# EAGLE design CSR8635-V1.2 (EAGLE 7.2.0)
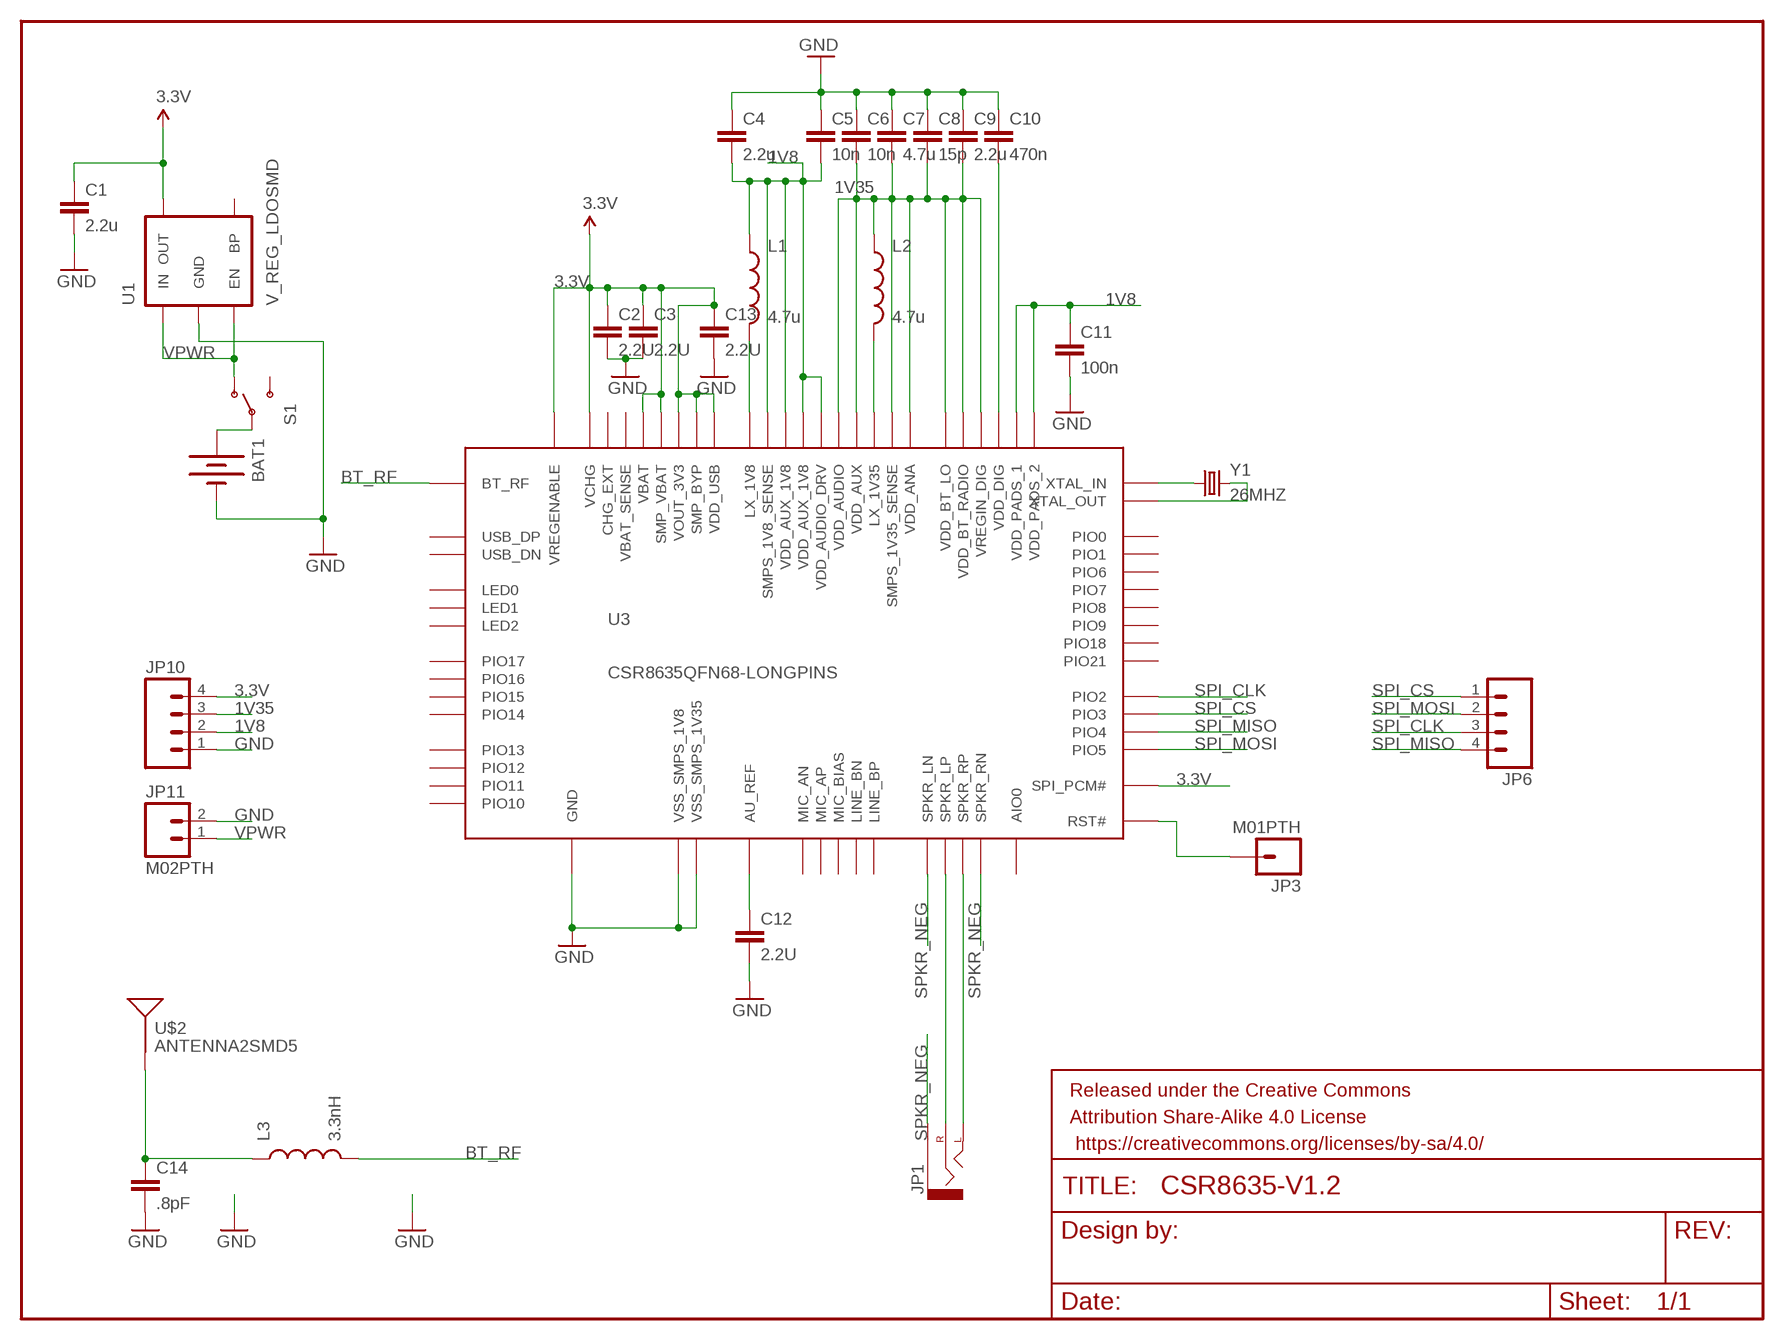
[diagram p0: schematic, sheet 1]

## Parts
BAT1  BATTERY9V  [BATTCON_9V]
C1  2.2u  CAP0603-CAP  [0603-CAP]
C2  2.2U  CAP0603-CAP  [0603-CAP]
C3  2.2U  CAP0603-CAP  [0603-CAP]
C4  2.2u  CAP0603-CAP  [0603-CAP]
C5  10n  CAP0603-CAP  [0603-CAP]
C6  10n  CAP0603-CAP  [0603-CAP]
C7  4.7u  CAP0603-CAP  [0603-CAP]
C8  15p  CAP0603-CAP  [0603-CAP]
C9  2.2u  CAP0603-CAP  [0603-CAP]
C10  470n  CAP0603-CAP  [0603-CAP]
C11  100n  CAP0603-CAP  [0603-CAP]
C12  2.2U  CAP0603-CAP  [0603-CAP]
C13  2.2U  CAP0603-CAP  [0603-CAP]
C14  .8pF  CAP0603-CAP  [0603-CAP]
FRAME1  FRAME-LETTER  [CREATIVE_COMMONS]
JP1  AUDIO-JACKSMD2  [AUDIO-JACK-3.5MM-SMD]
JP3  M01PTH  [1X01]
JP6  M04PTH  [1X04]
JP10  M04PTH  [1X04]
JP11  M02PTH  [1X02]
L1  4.7u  INDUCTOR0805  [0805]
L2  4.7u  INDUCTOR0805  [0805]
L3  3.3nH  INDUCTOR0805  [0805]
S1  SWITCH-SPDTPTH  [SWITCH-SPDT]
U1  V_REG_LDOSMD  [SOT23-5]
U3  CSR8635QFN68-LONGPINS  [QFN68]
U$2  ANTENNA2SMD5  [ANTENNA-CHIP5]
Y1  26MHZ  CRYSTALHC49US  [HC49US]

## Nets
1V8: C4.2 C5.2 C11.1 JP10.2 L1.1 U3.8(VDD_AUDIO_DRV) U3.15(VDD_AUX_1V8) U3.16(VDD_AUX_1V8) U3.33(VDD_PADS_1) U3.53(SMPS_1V8_SENSE) U3.63(VDD_PADS_2)
1V35: C6.2 C7.2 C8.2 C9.2 JP10.3 L2.1 U3.3(VDD_AUDIO) U3.11(VDD_BT_RADIO) U3.13(VDD_BT_LO) U3.14(VDD_AUX) U3.17(VDD_ANA) U3.39(VREGIN_DIG) U3.52(SMPS_1V35_SENSE)
3.3V: C1.1 C2.1 C3.1 C13.1 JP10.4 U1.5(OUT) U3.29(SPI_PCM#) U3.40(VREGENABLE) U3.41(VOUT_3V3) U3.42(VCHG) U3.45(VBAT) U3.48(SMP_VBAT) U3.49(SMP_BYP) U3.54(VDD_USB)
!SPI_PCM: JP3.1 U3.35(RST#)
BT_RF: L3.2 U3.12(BT_RF)
GND: BAT1.- C1.2 C2.2 C3.2 C4.1 C5.1 C6.1 C7.1 C8.1 C9.1 C10.1 C11.2 C12.2 C13.2 C14.2 JP10.1 JP11.2 U1.2(GND) U3.46(VSS_SMPS_1V8) U3.51(VSS_SMPS_1V35) U3.CNTR1(GND) U3.CNTR2(GND) U3.CNTR3(GND) U3.CNTR(GND)
N$1: BAT1.+ S1.2(P)
N$2: JP1.RING(RIGHT) U3.10(SPKR_LP)
N$3: L1.2 U3.47(LX_1V8)
N$4: U3.19(XTAL_IN) Y1.1
N$5: L2.2 U3.50(LX_1V35)
N$6: C10.2 U3.38(VDD_DIG)
N$7: U3.18(XTAL_OUT) Y1.2
N$8: JP1.TIP(LEFT) U3.7(SPKR_RP)
N$9: C12.1 U3.1(AU_REF)
N$10: C14.1 L3.1 U$2.FEED(SIGNAL)
SPI_CLK: JP6.3 U3.30(PIO2)
SPI_CS: JP6.1 U3.28(PIO3)
SPI_MISO: JP6.4 U3.24(PIO4)
SPI_MOSI: JP6.2 U3.34(PIO5)
SPKR_NEG: JP1.SLEEVE U3.6(SPKR_RN) U3.9(SPKR_LN)
VPWR: JP11.1 S1.1(O) U1.1(IN) U1.3(EN)
Unconnected: S1.3(S) U1.4(BP) U3.2(MIC_BIAS) U3.4(LINE_BN) U3.5(LINE_BP) U3.20(AIO0) U3.21(PIO15) U3.22(PIO12) U3.23(PIO14) U3.25(PIO10) U3.26(PIO11) U3.27(PIO16) U3.31(PIO13) U3.32(PIO17) U3.36(LED1) U3.37(LED0) U3.43(CHG_EXT) U3.44(VBAT_SENSE) U3.55(USB_DN) U3.56(USB_DP) U3.57(PIO7) U3.58(PIO9) U3.59(PIO0) U3.60(PIO1) U3.61(PIO8) U3.62(PIO6) U3.64(PIO21) U3.65(PIO18) U3.66(LED2) U3.67(MIC_AN) U3.68(MIC_AP)

## Library data of the parts
BAT1 = SparkFun-Electromechanical:BATTERY: Battery Holders Various common sizes : AA, AAA, 18650 (PRT-12895), 20mm coin cell and 12mm coin cell. 20MM_4LEGS, BATT-10373
C1-C14 = SparkFun-Passives:CAP: Capacitor Standard 0603 ceramic capacitor, and 0.1" leaded capacitor.
FRAME1 = SparkFun-Aesthetics:FRAME-LETTER: Schematic Frame Standard 8.5x11 US Letter frame
JP1 = SparkFun-Connectors:AUDIO-JACK: 3.5mm Audio Jack Simple 3.5mm common PCB mount audio jack. SKU: PRT-08032; PROD_ID: CONN-10353
JP3 = SparkFun-Connectors:M01: Header 1 Standard 1-pin 0.1" header. Use with straight break away headers (SKU : PRT-00116), right angle break away headers (PRT-00553), swiss pins (PRT-00743), machine pins (PRT-00117), and female headers (PRT-00115).
JP6 JP10 = SparkFun-Connectors:M04: Header 4 Standard 4-pin 0.1" header. Use with straight break away headers (SKU : PRT-00116), right angle break away headers (PRT-00553), swiss pins (PRT-00743), machine pins (PRT-00117), and female headers (PRT-00115). Molex polarized connector foot print use with SKU : PRT-08231 with associated crimp pins and housings. 1MM SMD Version SKU: PRT-10208
JP11 = SparkFun-Connectors:M02: Standard 2-pin 0.1" header. Use with - straight break away headers ( PRT-00116) - right angle break away headers (PRT-00553) - swiss pins (PRT-00743) - machine pins (PRT-00117) - female headers (PRT-00115) Molex polarized connector foot print use with: PRT-08233 with associated crimp pins and housings. 2.54_SCREWTERM for use with PRT-10571. 3.5mm Screw Terminal footprints for PRT-08084 5mm Screw Terminal footprints for use with PRT-08432
L1-L3 = SparkFun-Passives:INDUCTOR: Inductors Basic Inductor/Choke - 0603 and 1206. Footprints are not proven and vary greatly between part numbers. SRN6045- 33uH, 20% 1.4A SDR0403-560KL - 56uH, 10%, 500mA RMS/740mA peak
S1 = SparkFun-Electromechanical:SWITCH-SPDT: SPDT Switch Simple slide switch, Spark Fun Electronics SKU : COM-00102 DPDT SMT slide switch, AYZ0202, SWCH-08179; PROD_ID: SWCH-08261
U1 = SparkFun-PowerIC:V_REG_LDO: Voltage Regulator LDO Standard 150mA LDO voltage regulator in SOT-23 layout. Micrel part MIC5205. BP (by-pass) pin is used to lower output noise with 470pF cap.
U3 = Ilan:CSR8635
U$2 = SparkFun-RF:ANTENNA2: Chip antenna Single endded antenna. Common with smaller chip antennas. CHIP4 package is the GPS Chip Antenna SKU: GPS-08418. CHIP5 package is 2.4GHz chip antenna SKU: WRL-00144.
Y1 = SparkFun-FreqCtrl:CRYSTAL: Various standard crystals. Proven footprints.

## Board
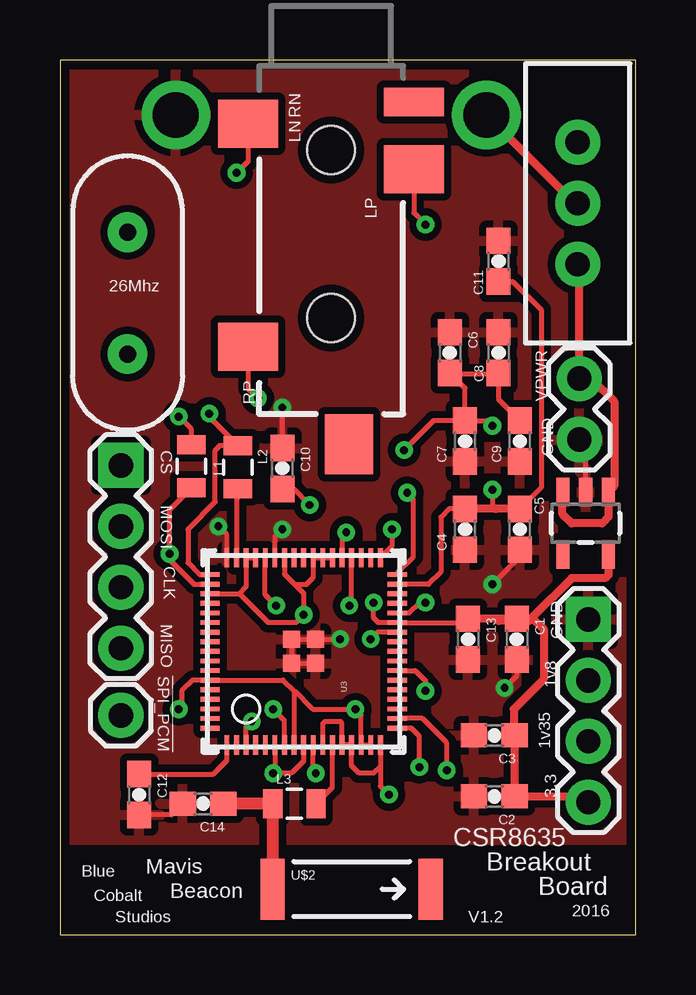
[diagram p1: board, top side]
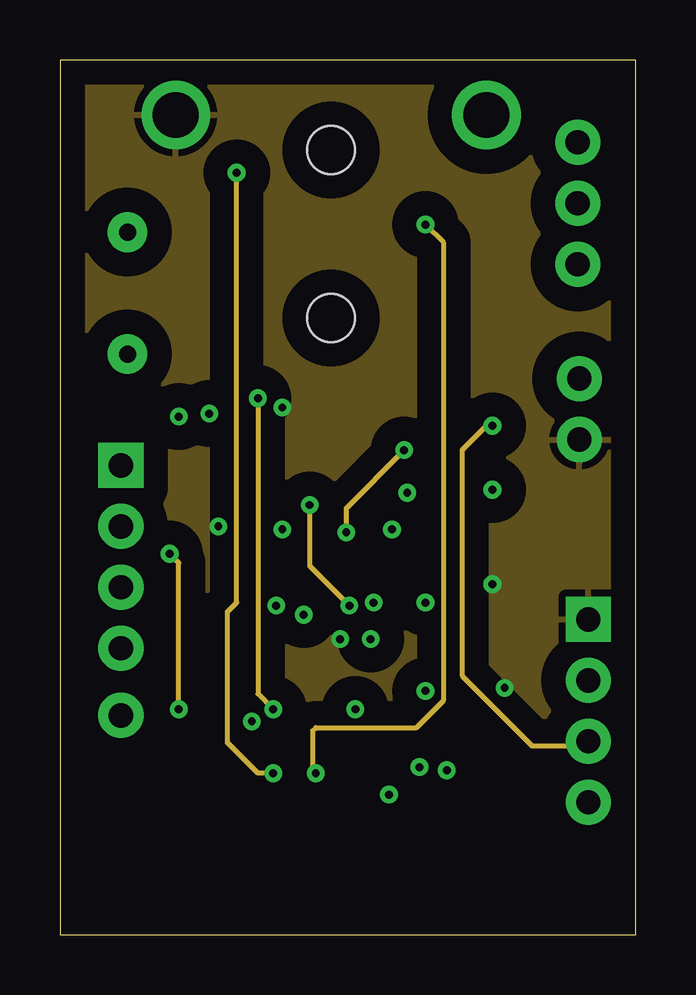
[diagram p2: board, inner layer Route2]
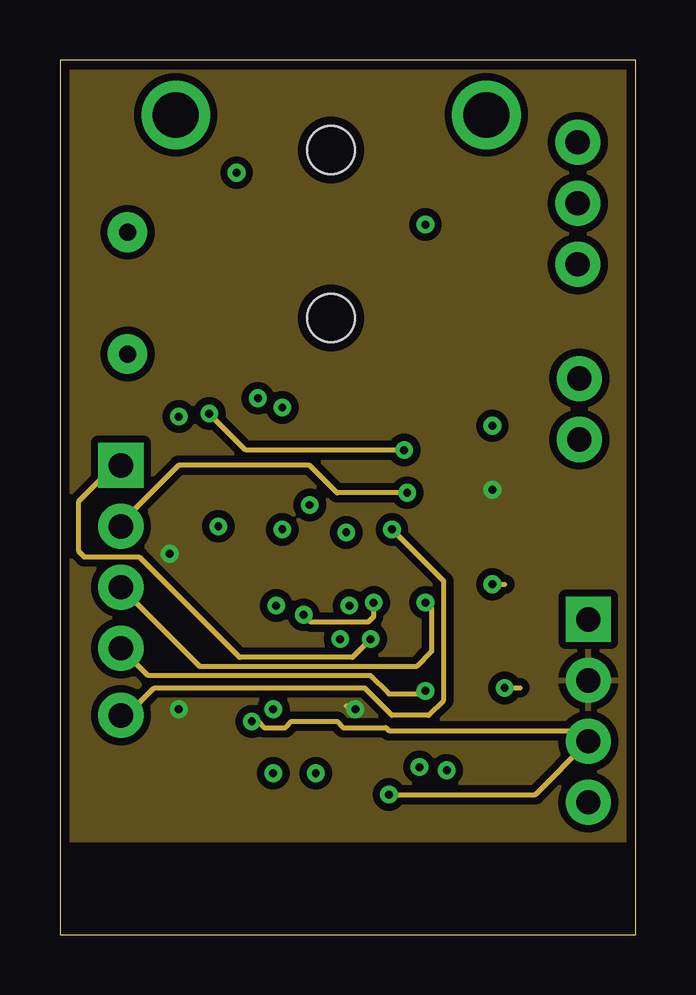
[diagram p3: board, inner layer Route15]
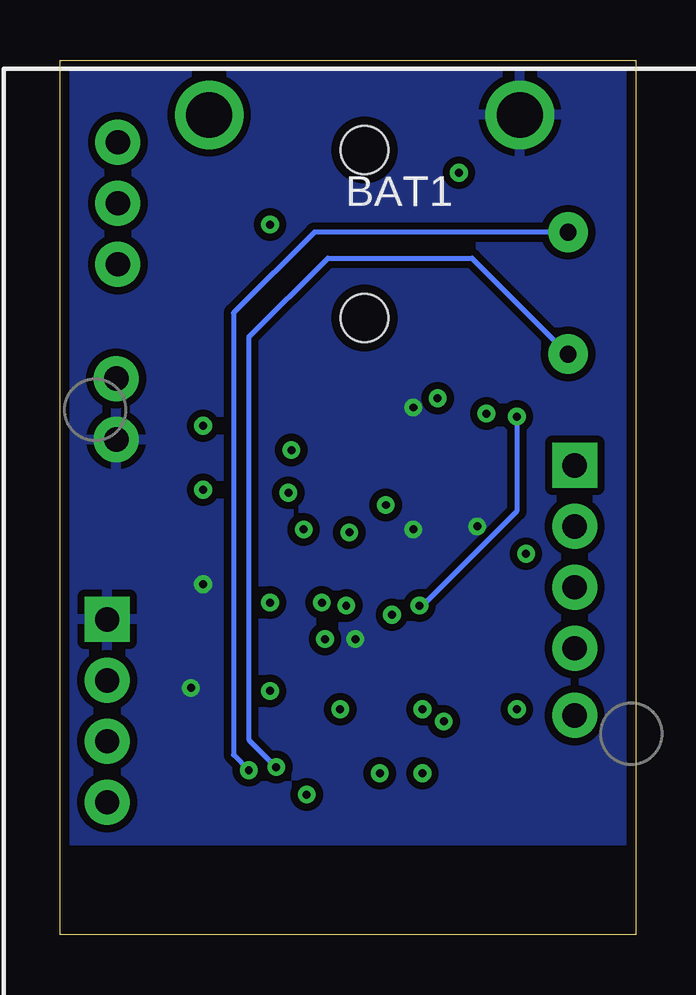
[diagram p4: board, bottom side, seen from below]

Size 24 x 36.45 mm. Coordinates in mm from the lower left corner, seen from the top.
Outline: 0,0 24,0 24,36.45 0,36.45 0,0
Copper layers (1*2*15*16): Top 0.035559375mm / dielectric 0.17018125mm / Route2 0.01778125mm / dielectric 47mil / Route15 0.01778125mm / dielectric 0.17018125mm / Bottom 0.035559375mm
Design rules "OSHPark-4layer *": minimum track width 5mil, minimum drill 10mil, track to track 7mil, track to pad 7mil, pad to pad 7mil, via to via 8mil, smd to smd 7mil, copper to edge 15mil, drill to drill 6mil, minimum pad ring 6mil, minimum via ring 8mil, stop-mask expansion 4mil, vias tented up to drill 25mil, thermal gap 12mil

### Footprints (pad centres in the part's own frame; a part is rotated, then mirrored left to right if it is on the bottom)
BATTCON_9V = drill 1.905: + 0,0; - 0,-12.954
0603-CAP = smd 1.1 x 1: 1 -0.85,0; 2 0.85,0
AUDIO-JACK-3.5MM-SMD = smd 2 x 2.5: RING 4.3,3.45; SLEEVE 2.4,-3.45; TIP 11.7,-3.45 | smd 1.2 x 2.5: RSH 1.5,3.45 | smd 2.5 x 2: TSH 15.75,0.75 | hole 2: 3.5,0; 10.5,0
1X01 = drill 1.016 pad 1.88: 1 0,0
1X04 = drill 1.016 pad 1.88 square: 1 0,0 | drill 1.016 pad 1.88: 2 2.54,0; 3 5.08,0; 4 7.62,0
1X02 = drill 1.016 pad 1.88: 1 0,0; 2 2.54,0
0805 = smd 0.8 x 1.2: 1 -0.9,0; 2 0.9,0
SWITCH-SPDT = drill 1.016 pad 1.88: 1 0,2.54; 2 0,0; 3 0,-2.54
SOT23-5 = smd 0.55 x 1.2: 1 -0.95,-1.3; 2 0,-1.3; 3 0.95,-1.3; 4 0.95,1.3; 5 -0.95,1.3
QFN68 = smd 0.8 x 0.2: 1 -3.9,3.2; 2 -3.9,2.8; 3 -3.9,2.4; 4 -3.9,2; 5 -3.9,1.6; 6 -3.9,1.2; 7 -3.9,0.8; 8 -3.9,0.4; 9 -3.9,0; 10 -3.9,-0.4; 11 -3.9,-0.8; 12 -3.9,-1.2; 13 -3.9,-1.6; 14 -3.9,-2; 15 -3.9,-2.4; 16 -3.9,-2.8; 17 -3.9,-3.2; 35 3.9,-3.2; 36 3.9,-2.8; 37 3.9,-2.4; 38 3.9,-2; 39 3.9,-1.6; 40 3.9,-1.2; 41 3.9,-0.8; 42 3.9,-0.4; 43 3.9,0; 44 3.9,0.4; 45 3.9,0.8; 46 3.9,1.2; 47 3.9,1.6; 48 3.9,2; 49 3.9,2.4; 50 3.9,2.8; 51 3.9,3.2 | smd 0.2 x 0.8: 18 -3.2,-3.9; 19 -2.8,-3.9; 20 -2.4,-3.9; 21 -2,-3.9; 22 -1.6,-3.9; 23 -1.2,-3.9; 24 -0.8,-3.9; 25 -0.4,-3.9; 26 0,-3.9; 27 0.4,-3.9; 28 0.8,-3.9; 29 1.2,-3.9; 30 1.6,-3.9; 31 2,-3.9; 32 2.4,-3.9; 33 2.8,-3.9; 34 3.2,-3.9; 52 3.2,3.9; 53 2.8,3.9; 54 2.4,3.9; 55 2,3.9; 56 1.6,3.9; 57 1.2,3.9; 58 0.8,3.9; 59 0.4,3.9; 60 0,3.9; 61 -0.4,3.9; 62 -0.8,3.9; 63 -1.2,3.9; 64 -1.6,3.9; 65 -2,3.9; 66 -2.4,3.9; 67 -2.8,3.9; 68 -3.2,3.9 | smd 0.7 x 0.7: CNTR 0.5,0.5; CNTR1 0.5,-0.5; CNTR2 -0.5,-0.5; CNTR3 -0.5,0.5
ANTENNA-CHIP5 = smd 1.016 x 2.54: FEED -3.302,0; NC 3.302,0
HC49US = drill 0.7 pad 1.651: 1 -2.54,0; 2 2.54,0

### Placement (x,y rotation side)
BAT1  17.78,34.16 90 bottom
C1  19.05,12.32 270 top
C2  18.11,5.77 180 top
C3  18.11,8.31 180 top
C4  16.89,16.89 90 top
C5  19.18,16.89 90 top
C6  16.26,24.26 270 top
C7  16.89,20.57 90 top
C8  18.29,24.26 270 top
C9  19.18,20.57 90 top
C10  9.27,19.43 270 top
C11  18.29,28.07 90 top
C12  3.3,5.84 270 top
C13  17.02,12.32 270 top
C14  5.97,5.46 180 top
FRAME1  116.59,78.49 0 top  (outside the outline)
JP1  11.3,36.2 270 top
JP3  2.54,9.14 0 top
JP6  2.54,19.56 270 top
JP10  22.03,13.14 270 top
JP11  21.65,23.17 270 top
L1  5.48,19.52 90 top
L2  7.42,19.48 270 top
L3  9.78,5.46 0 top
S1  21.59,30.48 180 top
U1  21.92,17.15 180 top
U3  10.16,11.81 90 top
U$2  12.16,1.9 0 top
Y1  2.82,26.73 270 top

### Tracks (layer width: path | path; a pad name or v marks a point on that pad's centre or on a via)
1V8  (via drill 0.33)
  Top 0.203: U3.16 U3.15 12.56,9.16 v12.32,9.4 10.54,9.4 9.78,10.16 9.75,10.16 | C4.2 16.22,17.74 15.88,17.4 15.88,15.11 15.37,14.6 U3.33 | C11.1 18.88,27.22 20.07,26.04 20.07,18.63 C5.2 18.38,17.74 | 9.75,10.16 9.3,10.61 U3.63 5.53,10.61 5.08,10.16 5.08,9.53 v4.95,9.4 | 9.75,10.16 U3.8 | v18.03,18.54 18.03,17.87 18.16,17.74 | U3.53 5.59,14.6 4.57,15.62 v4.57,15.87 4.57,17.71 L1.1
  Top 0.33: C5.2 18.16,17.74 C4.2
  Route2 0.203: v4.95,9.4 4.95,15.49 v4.57,15.87 | v18.03,18.54 18.03,18.8
  Route15 0.203: v12.32,9.4 12.19,9.53 11.94,9.53
  pour Route15 (isolate 0.305): 0,36.45 23.88,36.45 24,3.94 0,3.94
1V35  (via drill 0.33)
  Top 0.203: C7.2 16.89,22.77 C6.2 16.26,23.37 18.25,23.37 C8.2 18.29,22.31 C9.2 | U3.11 10.96,8.8 11.05,8.89 11.68,8.89 11.76,8.81 U3.13 U3.14 12.17,7.9 12.17,7.04 12.47,6.73 13.08,6.73 13.36,7.01 U3.17 13.36,6.2 v13.72,5.84 | U3.3 7.76,8.65 v8,8.89 | C7.2 17.82,21.42 v18.03,21.21 | 14.22,20.07 v14.35,20.19 15.58,21.42 C7.2 | v6.22,21.72 6.22,21.58 L2.1 6.67,20.38 6.48,20.19 6.48,18.03 5.33,16.89 5.33,15.49 5.82,15.01 U3.52 | v11.94,16.76 11.76,16.59 U3.39
  Route2 0.203: JP10.3 21.85,7.87 19.68,7.87 16.76,10.79 16.76,20.19 17.78,21.21 v18.03,21.21 | v11.94,16.76 11.94,17.78 v14.35,20.19
  Route15 0.203: v8,8.89 8.26,8.89 8.51,8.64 9.4,8.64 9.65,8.89 11.56,8.89 11.81,8.64 13.59,8.64 13.72,8.51 21.59,8.51 JP10.3 19.81,5.84 v13.72,5.84 | v14.35,20.19 7.75,20.19 v6.22,21.72
3.3V  (via drill 0.33)
  Top 0.203: U3.54 7.48,14.21 | 7.48,14.21 7.76,14.49 U3.49 U3.48 | 9.78,14.6 9.36,15.02 U3.45 | 9.78,14.6 10.29,14.6 10.56,14.88 U3.42 U3.41 U3.40 | v13.08,13.84 13.08,13.21 13.28,13.01 U3.29 16.85,13.01 C13.1 | 7.48,14.21 8.67,13.02 8.67,13.01 9.83,13.01 v10.16,13.33 10.16,14.22 9.78,14.6
  Top 0.33: JP10.4 22.03,5.77 C2.1 C3.1 18.92,8.34 18.92,9.4 20.19,10.67 20.19,12.7 19.68,13.21 | U1.5 22.87,15 22.73,14.86 21.34,14.86 19.68,13.21 | 19.68,13.21 19.56,13.08 19.14,13.08 | 19.14,13.08 C1.1 C13.1 | 19.14,13.08 18.29,13.08
  Route15 0.203: v13.08,13.84 13.08,13.26 12.85,13.03 10.46,13.03 v10.16,13.33
!SPI_PCM  (via drill 0.33)
  Top 0.203: v13.84,16.89 13.84,16.19 U3.35
  Route15 0.203: v13.84,16.89 16,14.73 16,9.78 15.37,9.14 13.84,9.14 12.7,10.29 3.94,10.29 2.79,9.14 JP3.1
BT_RF
  Top 0.203: L3.2 11.36,6.14 U3.12
GND  (via drill 0.33)
  Top 0.203: U1.2 21.92,20.37 JP11.2 | C1.2 19.05,10.79 v18.54,10.29 | C5.1 19.18,15.75 v18.03,14.6 | C10.1 v9.27,21.97 | U3.51 6.96,16.66 v6.6,17.02 | U3.46 8.96,16.58 v9.27,16.89 | U3.CNTR U3.CNTR3 U3.CNTR2 | U3.CNTR U3.CNTR1 | U3.CNTR v11.68,12.31 v11.68,12.32 | C14.2 4.65,4.99 C12.2
  Route15 0.203: 22.03,20.26 JP11.2 | v18.54,10.29 19.18,10.29 | v18.03,14.6 18.54,14.6
  Bottom 0.203: v9.27,21.97 9.27,22.1 9.4,22.23 | v6.6,17.02 6.6,17.15 6.48,17.27 | v9.27,16.89 9.27,17.15 | v11.68,12.32 11.81,12.32
  pour Top (isolate 0.305): 0,36.45 24,36.45 24,3.94 0,3.94
  pour Bottom (isolate 0.305): 0,36.45 24,36.45 24,3.94 0,3.94
  pour Route2 (isolate 1.016): 0,36.45 23.88,36.45 23.88,3.94 0,3.94
N$1
  Top 0.33: S1.2 21.46,30.48 BAT1.+
N$2  (via drill 0.33)
  Top 0.203: JP1.RING 14.75,30.08 v15.24,29.59 | v10.67,6.73 10.56,6.84 U3.10
  Route2 0.203: v15.24,29.59 16,28.83 16,9.78 14.86,8.64 10.67,8.64 10.54,8.51 10.54,6.86 v10.67,6.73
N$3  (via drill 0.33)
  Top 0.203: L1.2 5.48,21.06 v4.95,21.59 | v9.02,13.72 8.56,14.17 U3.47
  Bottom 0.203: v4.95,21.59 4.95,17.65 8.89,13.72 v9.02,13.72
N$4  (via drill 0.33)
  Top 0.203: v16.13,6.86 16.13,8 15.11,9.02 14.07,9.02 U3.19
  Bottom 0.203: Y1.1 13.4,29.27 16.76,25.91 16.76,7.49 v16.13,6.86
N$5
  Top 0.203: L2.2 7.42,18.21 7.37,18.16 7.37,15.72 U3.50
N$6  (via drill 0.33)
  Top 0.203: C10.2 9.74,18.58 v10.41,17.91 | U3.38 12.17,15.7 12.17,13.82 v12.07,13.72
  Route2 0.203: v10.41,17.91 10.41,15.37 v12.07,13.72
N$7  (via drill 0.33)
  Top 0.203: v14.99,6.99 14.99,8.28 14.66,8.61 U3.18 | U3.18
  Bottom 0.203: v14.99,6.99 16.13,8.13 16.13,24.89 12.83,28.19 6.82,28.19 Y1.2
N$8  (via drill 0.33)
  Top 0.203: JP1.TIP 7.85,22.75 v8.26,22.35 | v8.89,9.4 9.36,8.93 U3.7
  Route2 0.203: v8.26,22.35 8.26,10.03 v8.89,9.4
N$9
  Top 0.203: C12.1 6.39,6.69 6.96,7.26 U3.1 | U3.1
N$10
  Top 0.508: U$2.FEED 8.88,1.9 L3.1 C14.1
SPI_CLK  (via drill 0.33)
  Top 0.203: U3.30 14.55,13.41 14.99,13.84 v15.24,13.84
  Route15 0.203: v15.24,13.84 15.49,13.59 15.49,11.81 14.86,11.18 5.84,11.18 JP6.3
SPI_CS  (via drill 0.33)
  Top 0.203: U3.28 13.25,12.61 v12.95,12.32
  Route15 0.203: JP6.1 2.29,19.56 0.76,18.03 0.76,16 1.02,15.75 3.3,15.75 7.49,11.56 12.19,11.56 v12.95,12.32
SPI_MISO  (via drill 0.33)
  Top 0.203: U3.24 14.82,11.01 15.24,10.59 v15.24,10.16
  Route15 0.203: JP6.4 3.68,10.79 12.95,10.79 13.72,10.03 15.11,10.03 v15.24,10.16
SPI_MOSI  (via drill 0.33)
  Top 0.203: U3.34 14.06,15.08 14.73,15.75 14.73,18.16 v14.48,18.41
  Route15 0.203: v14.48,18.41 11.56,18.41 10.41,19.56 4.95,19.56 2.54,17.15 JP6.2
SPKR_NEG  (via drill 0.33)
  Top 0.203: JP1.SLEEVE 7.85,32.24 v7.37,31.75 | v8.89,6.73 8.89,6.81 8.94,6.86 | U3.9 10.16,7.24 9.65,6.73 v8.89,6.73 | U3.6 8.96,6.8 v8.89,6.73
  Route2 0.203: v8.89,6.73 8.26,6.73 6.98,8 6.98,13.46 7.37,13.84 v7.37,31.75
VPWR
  Top 0.33: U1.3 20.95,18.43 20.95,17.53 21.34,17.15 22.61,17.15 22.87,17.41 U1.1 23.11,18.69 23.11,22.23 22.16,23.18 JP11.1 21.66,27.88 S1.1

### Text on the board
tPlace: RN | LN | LP | 26Mhz | RP | VPWR | CS | GND | MOSI | CLK | MISO | GND | !SPI_PCM | 1v8 | 1v35 | 3.3 | CSR8635 | Blue | Mavis | Breakout | Cobalt | Beacon | Board | Studios | V1.2 | 2016